# EAGLE design motors (EAGLE 9.3.0)
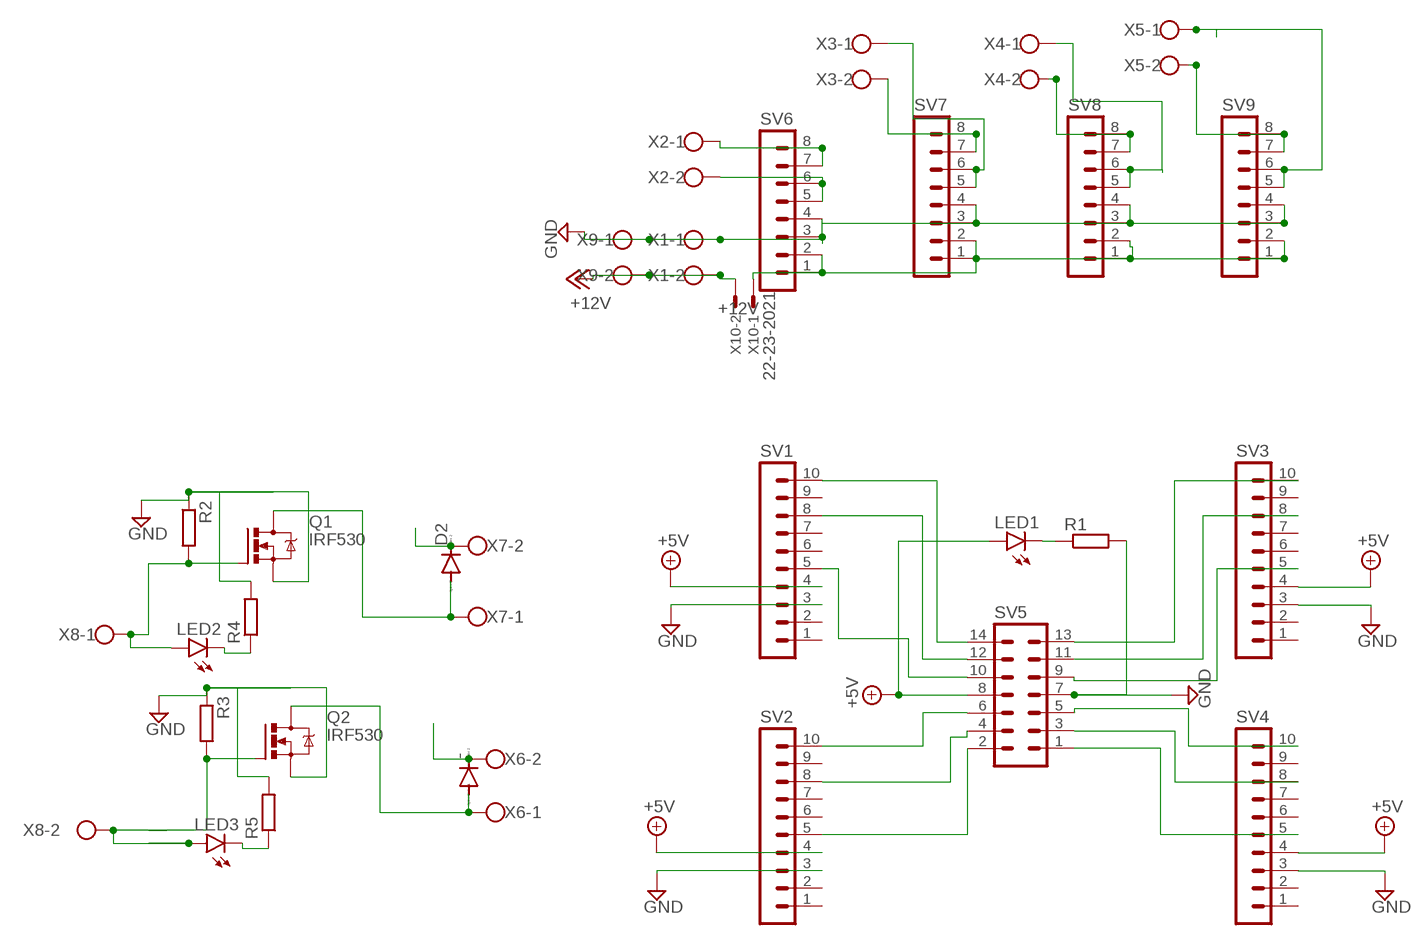
[diagram p0: schematic, sheet 1]

## Parts
-  DIODE-DO41-7.6  [DO41-7.6]
D2  DIODE-DO41-7.6  [DO41-7.6]
LED1  LED5MM  [LED5MM]
LED2  LED5MM  [LED5MM]
LED3  LED5MM  [LED5MM]
Q1  IRF530  [TO220BV]
Q2  IRF530  [TO220BV]
R1  R-EU_0207/7  [0207/7]
R2  R-EU_0207/7  [0207/7]
R3  R-EU_0207/7  [0207/7]
R4  R-EU_0207/7  [0207/7]
R5  R-EU_0207/7  [0207/7]
SV1  MA10-1  [MA10-1]
SV2  MA10-1  [MA10-1]
SV3  MA10-1  [MA10-1]
SV4  MA10-1  [MA10-1]
SV5  MA07-2  [MA07-2]
SV6  MA08-1  [MA08-1]
SV7  MA08-1  [MA08-1]
SV8  MA08-1  [MA08-1]
SV9  MA08-1  [MA08-1]
X1  W237-102  [W237-102]
X2  W237-102  [W237-102]
X3  W237-102  [W237-102]
X4  W237-102  [W237-102]
X5  W237-102  [W237-102]
X6  W237-102  [W237-102]
X7  W237-102  [W237-102]
X8  W237-102  [W237-102]
X9  W237-102  [W237-102]
X10  22-23-2021  [22-23-2021]

## Nets
+5V: LED1.A SV1.4 SV2.4 SV3.4 SV4.4 SV5.8
+12V: X1.2 X9.2 X10.2
GND: Q1.S Q2.S R1.2 R2.1 R3.1 R4.2 R5.2 SV1.3 SV2.3 SV3.3 SV4.3 SV5.7 SV6.3 SV6.4 SV7.3 SV7.4 SV8.3 SV8.4 SV9.3 SV9.4 X1.1 X9.1
N$1: SV3.10 SV5.13
N$2: SV3.8 SV5.11
N$3: SV3.5 SV5.9
N$4: SV4.10 SV5.5
N$5: SV4.8 SV5.3
N$6: SV4.5 SV5.1
N$7: SV2.5 SV5.2
N$8: SV2.8 SV5.4
N$9: SV2.10 SV5.6
N$10: SV1.5 SV5.10
N$11: SV1.8 SV5.12
N$12: SV1.10 SV5.14
N$13: LED1.K(C) R1.1
N$14: LED2.K(C) R4.1
N$15: LED3.A Q2.G R3.2 X8.2
N$16: D2.A Q1.D X7.1
N$18: LED3.K(C) R5.1
N$19: -.A Q2.D X6.1
N$20: SV9.7 SV9.8 X5.2
N$22: -.C D2.C SV6.1 SV6.2 SV7.1 SV7.2 SV8.1 SV8.2 SV9.1 SV9.2 X6.2 X7.2 X10.1
N$23: SV6.7 SV6.8 X2.1
N$24: SV6.5 SV6.6 X2.2
N$25: SV7.5 SV7.6 X3.1
N$26: SV7.7 SV7.8 X3.2
N$27: SV8.5 SV8.6 X4.1
N$29: LED2.A Q1.G R2.2 X8.1
N$30: SV8.7 SV8.8 X4.2
N$34: SV9.5 SV9.6 X5.1
Unconnected: SV1.1 SV1.2 SV1.6 SV1.7 SV1.9 SV2.1 SV2.2 SV2.6 SV2.7 SV2.9 SV3.1 SV3.2 SV3.6 SV3.7 SV3.9 SV4.1 SV4.2 SV4.6 SV4.7 SV4.9

## Library data of the parts
- D2 = diode:DIODE-: DIODE
LED1-LED3 = led:LED: LED OSRAM: - CHIPLED LG R971, LG N971, LY N971, LG Q971, LY Q971, LO R971, LY R971 LH N974, LH R974 LS Q976, LO Q976, LY Q976 LO Q996 - Hyper CHIPLED LW Q18S LB Q993, LB Q99A, LB R99A - SideLED LS A670, LO A670, LY A670, LG A670, LP A670 LB A673, LV A673, LT A673, LW A673 LH A674 LY A675 LS A676, LA A676, LO A676, LY A676, LW A676 LS A679, LY A679, LG A679 - Hyper Micro SIDELED® LS Y876, LA Y876, LO Y876, LY Y876 LT Y87S - SmartLED LW L88C, LW L88S LB L89C, LB L89S, LG L890 LS L89K, LO L89K, LY L89K LS L896, LA L896, LO L896, LY L896 - TOPLED LS T670, LO T670, LY T670, LG T670, LP T670 LSG T670, LSP T670, LSY T670, LOP T670, LYG T670 LG T671, LOG T671, LSG T671 LB T673, LV T673, LT T673, LW T673 LH T674 LS T676, LA T676, LO T676, LY T676, LB T676, LH T676, LSB T676, LW T676 LB T67C, LV T67C, LT T67C, LS T67K, LO T67K, LY T67K, LW E67C LS E67B, LA E67B, LO E67B, LY E67B, LB E67C, LV E67C, LT E67C LW T67C LS T679, LY T679, LG T679 LS T770, LO T770, LY T770, LG T770, LP T770 LB T773, LV T773, LT T773, LW T773 LH T774 LS E675, LA E675, LY E675, LS T675 LS T776, LA T776, LO T776, LY T776, LB T776 LHGB T686 LT T68C, LB T68C - Hyper Mini TOPLED® LB M676 - Mini TOPLED Santana® LG M470 LS M47K, LO M47K, LY M47K Source: http://www.osram.convergy.de LUXEON: - LUMILED® LXK2-PW12-R00, LXK2-PW12-S00, LXK2-PW14-U00, LXK2-PW14-V00 LXK2-PM12-R00, LXK2-PM12-S00, LXK2-PM14-U00 LXK2-PE12-Q00, LXK2-PE12-R00, LXK2-PE12-S00, LXK2-PE14-T00, LXK2-PE14-U00 LXK2-PB12-K00, LXK2-PB12-L00, LXK2-PB12-M00, LXK2-PB14-N00, LXK2-PB14-P00, LXK2-PB14-Q00 LXK2-PR12-L00, LXK2-PR12-M00, LXK2-PR14-Q00, LXK2-PR14-R00 LXK2-PD12-Q00, LXK2-PD12-R00, LXK2-PD12-S00 LXK2-PH12-R00, LXK2-PH12-S00 LXK2-PL12-P00, LXK2-PL12-Q00, LXK2-PL12-R00 Source: www.luxeon.com KINGBRIGHT: KA-3528ASYC Source: www.kingbright.com
Q1 Q2 = transistor-power:IRF530: HEXFET Power MOSFET
R1-R5 = rcl:R-EU_: RESISTOR, European symbol; SPICEPREFIX: R
SV1-SV4 = con-lstb:MA10-1: PIN HEADER; OC_FARNELL: unknown; OC_NEWARK: unknown
SV5 = con-lstb:MA07-2: PIN HEADER; OC_FARNELL: unknown; OC_NEWARK: unknown
SV6-SV9 = con-lstb:MA08-1: PIN HEADER; OC_FARNELL: unknown; OC_NEWARK: unknown
X1-X9 = con-wago-500:W237-102: WAGO SCREW CLAMP; MPN: 237-102; OC_FARNELL: unknown; OC_NEWARK: 70K9898
X10 = con-molex:22-23-2021: .100" (2.54mm) Center Header - 2 Pin; MF: MOLEX; MPN: 22-23-2021; OC_FARNELL: 1462926; OC_NEWARK: 25C3832

## Board
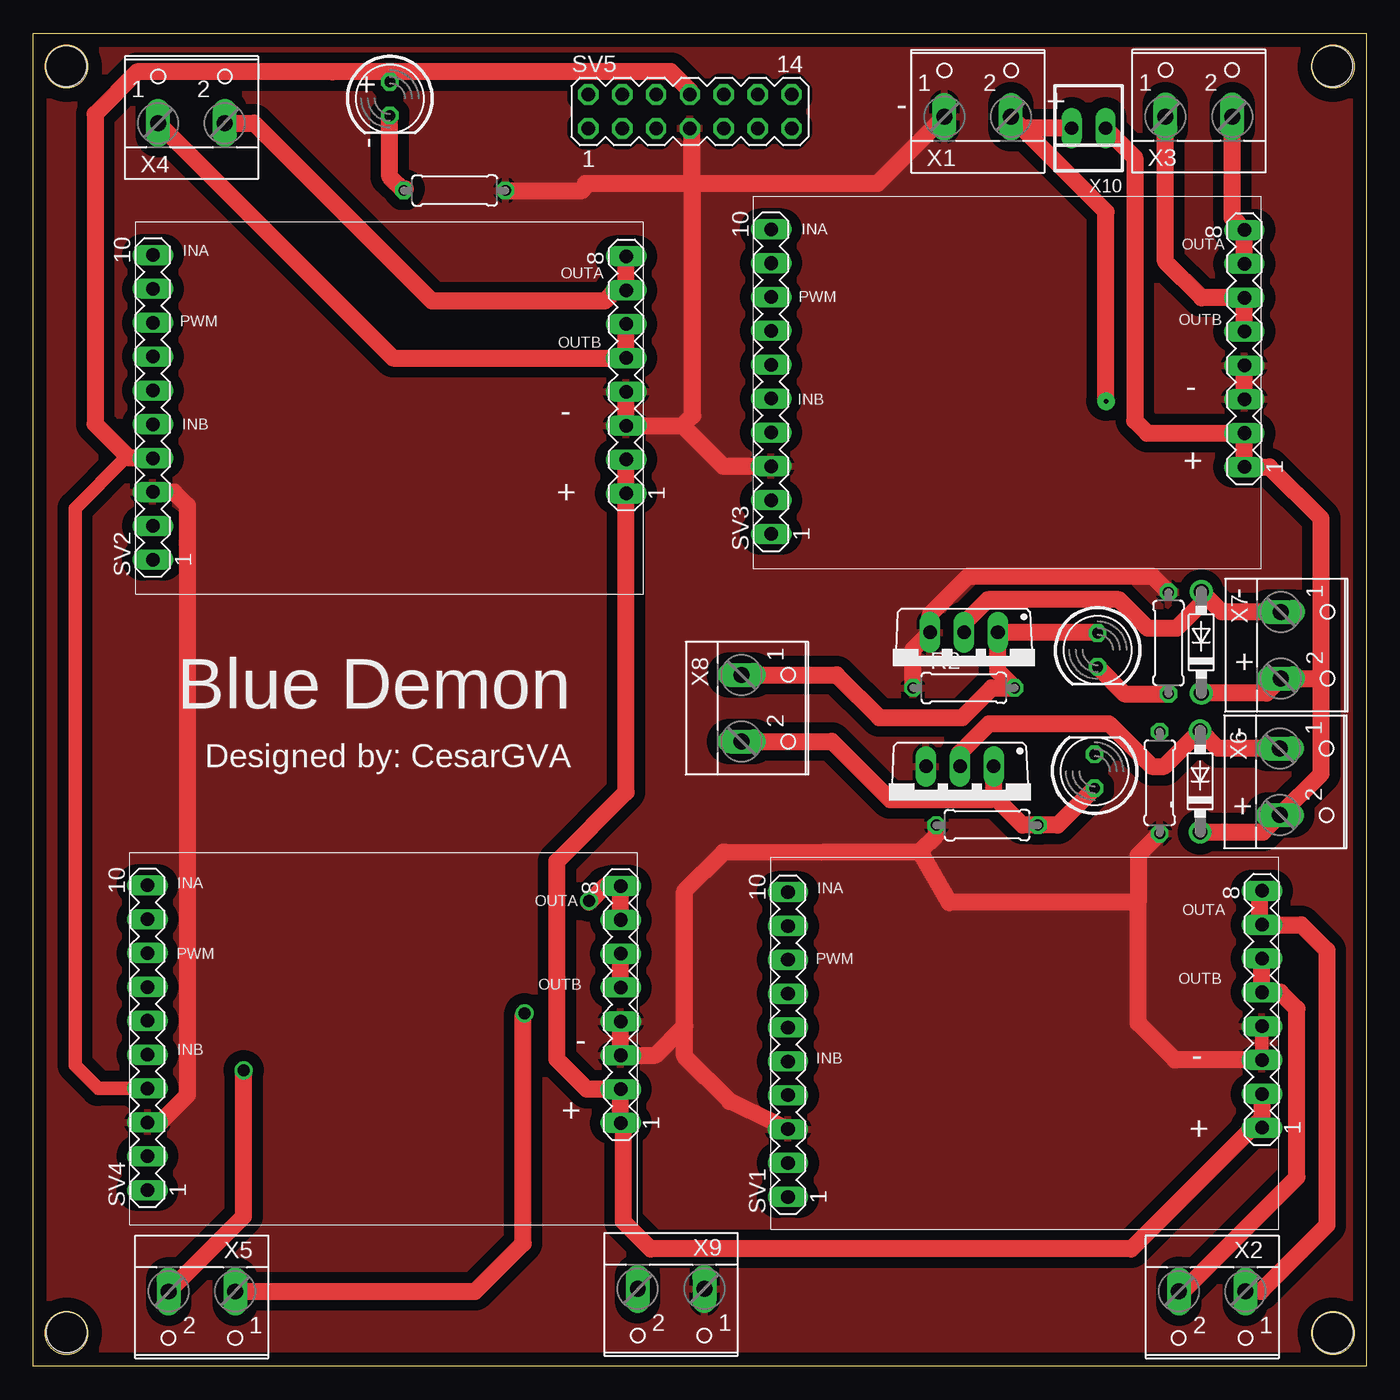
[diagram p1: board, top side]
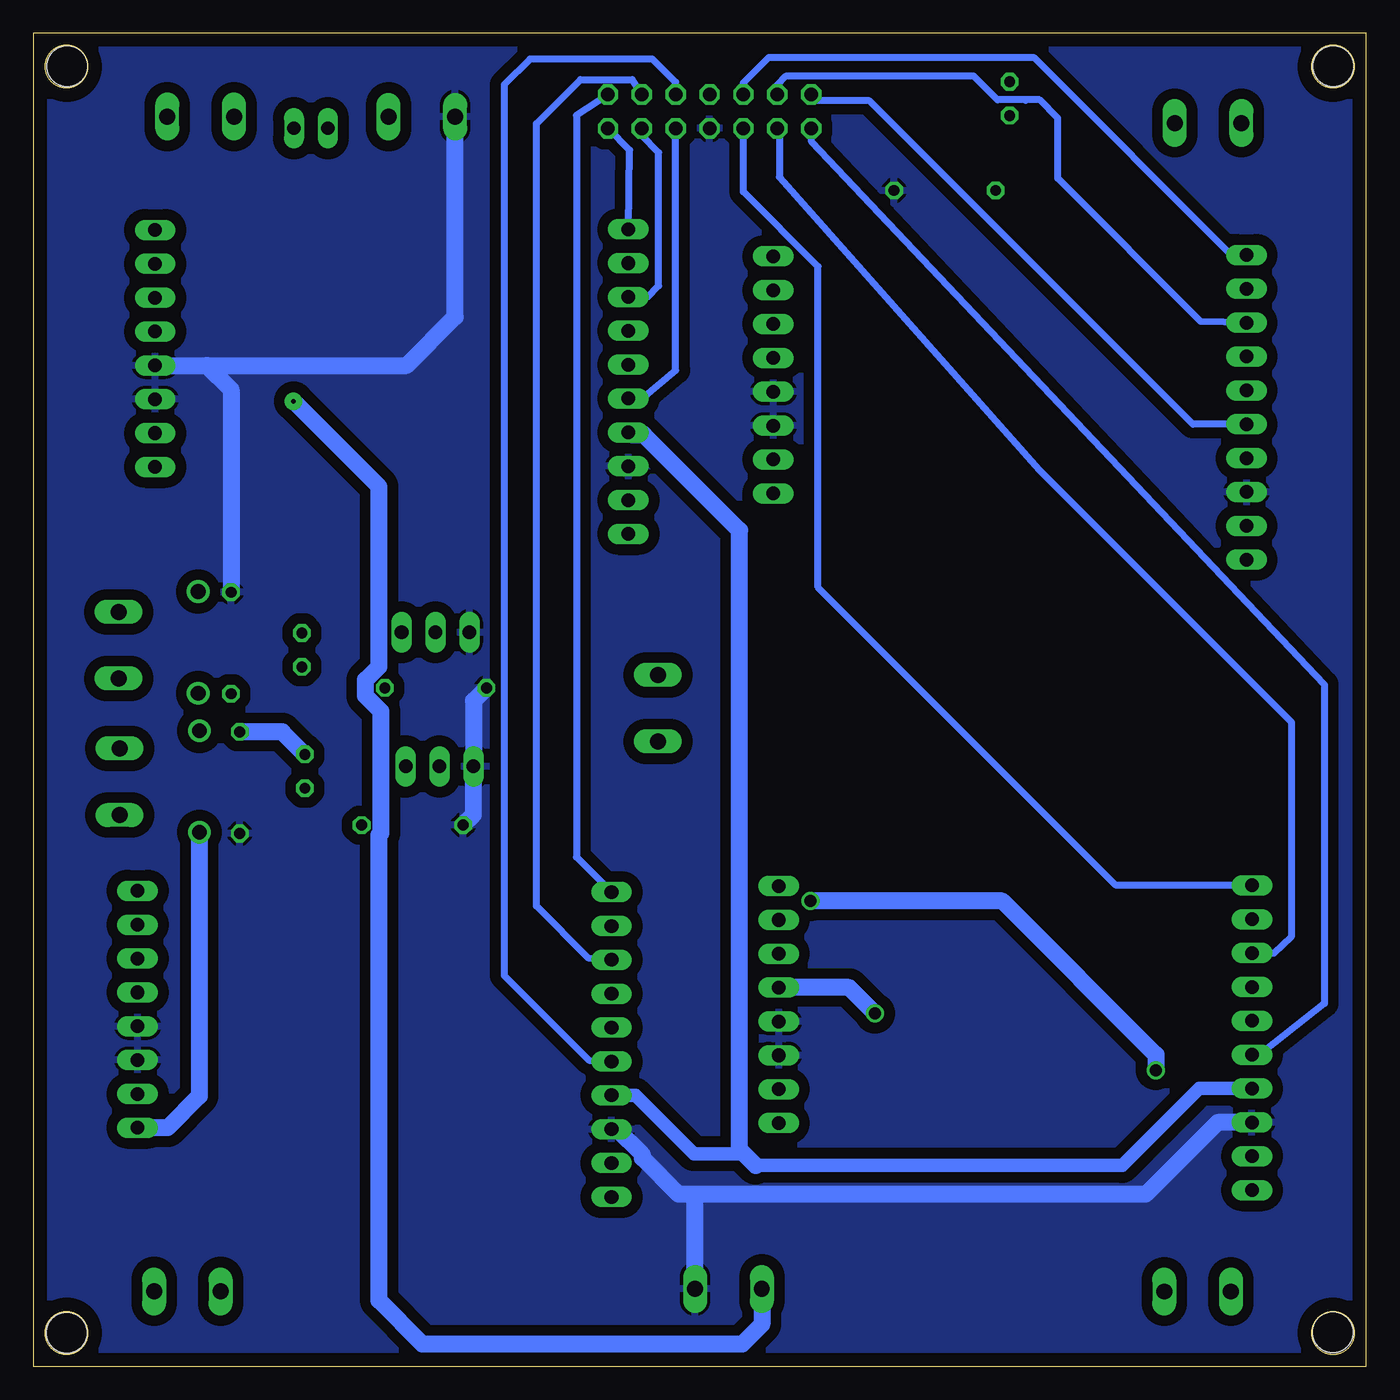
[diagram p2: board, bottom side, seen from below]

Size 100 x 100 mm. Coordinates in mm from the lower left corner, seen from the top.
Outline: 0,100 100,100 100,0 0,0 0,100
Outline: circle at 2.5,97.5 radius 1.6
Outline: circle at 97.5,97.5 radius 1.6
Outline: circle at 97.5,2.5 radius 1.6
Outline: circle at 2.5,2.5 radius 1.6
Copper layers (1*16): Top 0.035mm / dielectric 1.5mm / Bottom 0.035mm
Design rules "default": minimum track width 6mil, minimum drill 0.35mm, track to track 6mil, track to pad 6mil, pad to pad 6mil, via to via 6mil, smd to smd 6mil, copper to edge 40mil, drill to drill 6mil, minimum pad ring 10mil, minimum via ring 8mil, stop-mask expansion 4mil, vias tented up to drill 0mil, thermal gap 10mil
Holes 3.05 mm at 2.48,97.53 97.47,97.55 97.51,2.52 2.49,2.55

### Footprints (pad centres in the part's own frame; a part is rotated, then mirrored left to right if it is on the bottom)
DO41-7.6 = drill 1.1 pad 1.7: A 3.81,0; C -3.81,0
LED5MM = drill 0.813 octagon: A -1.27,0; K 1.27,0
TO220BV = drill 1.016 long: D 0,-2.54; G -2.54,-2.54; S 2.54,-2.54
0207/7 = drill 0.813 octagon: 1 -3.81,0; 2 3.81,0
MA10-1 = drill 1.016 long: 1 -11.43,0; 2 -8.89,0; 3 -6.35,0; 4 -3.81,0; 5 -1.27,0; 6 1.27,0; 7 3.81,0; 8 6.35,0; 9 8.89,0; 10 11.43,0
MA07-2 = drill 1.016 octagon: 1 -7.62,-1.27; 2 -7.62,1.27; 3 -5.08,-1.27; 4 -5.08,1.27; 5 -2.54,-1.27; 6 -2.54,1.27; 7 0,-1.27; 8 0,1.27; 9 2.54,-1.27; 10 2.54,1.27; 11 5.08,-1.27; 12 5.08,1.27; 13 7.62,-1.27; 14 7.62,1.27
MA08-1 = drill 1.016 long: 1 -8.89,0; 2 -6.35,0; 3 -3.81,0; 4 -1.27,0; 5 1.27,0; 6 3.81,0; 7 6.35,0; 8 8.89,0
W237-102 = drill 1.194 long: 1 -2.5,-1.27; 2 2.5,-1.27
22-23-2021 = drill 1 long: 1 -1.27,0; 2 1.27,0

### Placement (x,y rotation side)
-  87.54,43.87 90 top
D2  87.63,54.31 90 top
LED1  26.75,95.1 270 top
LED2  79.85,53.74 270 top
LED3  79.63,44.64 90 top
Q1  69.83,52.52 180 top
Q2  69.53,42.46 180 top
R1  31.61,88.21 0 top
R2  69.82,50.89 0 top
R3  71.56,40.6 0 top
R4  85.17,54.26 90 top
R5  84.51,43.78 270 top
SV1  56.62,24.13 90 top
SV2  8.97,71.94 90 top
SV3  55.35,73.87 90 top
SV4  8.56,24.64 90 top
SV5  49.27,94.13 0 top
SV6  92.18,26.77 90 top
SV7  90.86,76.36 90 top
SV8  44.48,74.37 90 top
SV9  44.07,27.13 90 top
X1  70.86,95.01 0 top
X2  88.44,4.34 180 top
X3  87.44,95.03 0 top
X4  11.87,94.54 0 top
X5  12.64,4.33 180 top
X6  94.8,43.84 270 top
X7  94.88,54.09 270 top
X8  54.41,49.37 270 top
X9  47.85,4.52 180 top
X10  79.17,92.88 180 top

### Tracks (layer width: path | path; a pad name or v marks a point on that pad's centre or on a via)
+5V
  Top 1.016: SV4.4 4.87,20.83 3.13,22.57 3.13,64.35 6.86,68.08 8.93,68.08 SV2.4
  Top 1.27: SV2.4 8.94,68.15 7.16,68.15 4.63,70.68 4.63,93.94 7.79,97.11 22.44,97.11 22.43,97.12 26.91,97.12 | SV5.8 49.27,95.7 47.84,97.12 26.91,97.12 | LED1.A 26.91,97.12
  Bottom 1.016: SV1.4 54.82,20.32 50.44,15.94 46.69,15.94 | 45.81,15.06 18.3,15.06 12.53,20.83 SV4.4 8.66,20.73
  Bottom 1.27: 45.81,15.06 46.69,15.94 47.02,16.27 47.02,62.71 54.22,69.9 55.2,69.9 SV3.4
+12V  (via drill 0.35 pad 1.3)
  Top 1.27: v80.49,72.4 80.49,86.61 X1.2 74.21,92.88 X10.2
  Bottom 1.27: X9.2 45.35,3.13 46.83,1.65 70.8,1.65 74.07,4.93 74.07,39.84 73.92,40 73.92,49.13 75.07,50.29 75.07,51.49 74.07,52.49 74.07,65.99 v80.49,72.4
GND
  Top 1.016: SV6.3 SV6.4
  Top 1.27: SV4.3 9.53,18.29 11.56,20.32 11.56,64.57 10.55,65.59 SV2.3 | R1.2 41.21,88.21 41.43,88.75 49.4,88.75 | SV1.3 52.25,19.87 48.86,23.25 48.86,25.52 | SV9.4 SV9.3 46.66,23.32 48.86,25.52 | SV7.3 SV7.4 | 66.52,38.61 51.9,38.56 51.77,38.56 48.86,35.66 48.86,25.52 | 66.52,38.61 68.73,34.79 82.89,34.79 | R2.1 66.01,53.78 Q1.S 67.29,56.36 67.34,56.41 67.34,56.46 70.14,59.26 83.97,59.26 R4.2 | R5.2 82.89,38.35 82.89,34.79 | SV6.3 85.67,22.96 82.89,25.74 82.89,34.79 | SV8.4 SV8.3 48.71,70.56 | 66.52,38.61 67.75,39.83 R3.1 | 49.4,88.75 49.4,92.73 SV5.7 | 49.4,88.75 63.36,88.75 X1.1 | 48.71,70.56 51.76,67.52 SV3.3 | 48.71,70.56 49.46,71.31 49.46,88.69 49.4,88.75
  Bottom 1.27: 50.1,12.9 16.53,12.9 11.15,18.29 SV4.3 | 50.1,12.9 51.59,12.9 54.31,15.62 54.31,15.88 56.21,17.78 SV1.3 | SV8.3 44.53,70.61 | R2.1 66.99,49.91 Q2.S 66.99,41.36 R3.1 | SV7.4 86.98,75.09 | 86.98,75.09 72.01,75.09 68.36,78.74 X1.1 | 86.98,75.09 85.17,73.28 R4.2 | X9.1 50.35,12.66 50.1,12.9
  pour Top (isolate 0.813): 1.21,99.54 98.4,99.54 99.33,98.61 99.33,0.34 98.4,-0.59 1.59,-0.59 -0.64,1.64 -0.64,97.7 1.21,99.55
  pour Bottom (isolate 0.813): 0.07,101.44 100.84,101.44 101.26,101.02 101.26,-1.15 101.24,-1.17 -1.46,-1.17 -1.46,99.91
N$1
  Bottom 0.508: SV3.10 55.26,91.24 SV5.13
N$2
  Bottom 0.508: SV3.8 53.93,80.22 53.08,81.06 53.08,91.06 54.35,92.32 SV5.11
N$3
  Bottom 0.508: SV3.5 54.35,72.6 51.8,74.71 51.81,74.71 SV5.9
N$4
  Bottom 0.508: SV4.10 18.77,36.07 41.13,58.42 41.13,82.5 46.73,88.1 SV5.5
N$5
  Bottom 0.508: SV4.8 6.9,30.99 5.59,32.25 5.59,48.3 24.51,67.22 44.02,89.21 44.02,92.7 SV5.3
N$6
  Bottom 0.508: SV5.1 41.65,91.91 3.13,51.13 3.13,27.2 8.31,23.12 SV4.5
N$7
  Bottom 0.508: SV5.2 41.22,94.98 37.31,94.98 13,70.67 SV2.5
N$8
  Bottom 0.508: 25.55,94.96 25.56,95 | 25.56,95 27.65,95 29.45,96.8 43.52,96.8 44.19,96.13 SV5.4 | 8.97,78.35 SV2.8 12.41,78.38 23.15,89.12 23.15,93.65 24.5,95 25.56,95
N$9
  Bottom 0.508: SV5.6 46.73,96.28 44.82,98.19 24.94,98.19 10.12,83.37 SV2.10
N$10
  Bottom 0.508: SV5.10 51.81,96.33 53.55,98.07 62.74,98.07 64.66,96.15 64.66,29.3 58.31,22.95 SV1.5
N$11
  Bottom 0.508: SV1.8 58.34,30.59 62.26,34.52 62.26,93.22 58.96,96.52 55.08,96.52 SV5.12
N$12
  Bottom 0.508: SV5.14 59.26,93.85 59.26,38.2 SV1.10
N$13
  Top 1.27: 27.92,88.33 R1.1 26.75,89.26 LED1.K
N$14
  Top 1.27: LED2.K 81.87,50.45 R4.1
N$15
  Top 1.27: X8.2 59.91,46.87 64.27,42.51 71.83,42.51 72.07,42.74 | 72.07,42.74 Q2.G | 72.07,42.74 74.21,40.6 R3.2 76.86,40.6 LED3.A
N$16
  Top 1.27: X7.1 89.15,56.59 D2.A 87.63,57.21 85.77,55.35 83.62,55.35 81.46,57.5 71.6,57.5 69.83,55.73 Q1.D
N$18
  Bottom 1.27: LED3.K 81.31,47.59 R5.1
N$19
  Top 1.27: Q2.D 69.52,46.01 71.72,48.21 80.69,48.21 83.91,45 84.85,45 -.A 88.88,46.34 X6.1
N$20  (via drill 0.9 pad 1.3)
  Top 1.27: SV9.7 SV9.8 42.9,36.02 41.68,34.8 v41.68,34.9 | X5.2 15.78,11.23 v15.78,22.2
  Bottom 1.27: v41.68,34.9 27.31,34.9 15.78,23.37 v15.78,22.2
N$22
  Top 1.27: SV8.2 SV8.1 44.48,43.08 39.28,37.88 39.28,23.03 41.53,20.78 SV9.2 SV9.1 44.26,18.05 44.26,10.84 46.31,8.79 82.38,8.79 91.82,18.24 | 91.82,18.24 SV6.1 | SV6.2 92.18,18.6 91.82,18.24 | X10.1 82.64,90.68 82.64,70.93 83.57,70.01 SV7.2 SV7.1 92.74,67.47 96.63,63.58 96.63,51.71 | 96.63,51.71 96.63,44.44 X6.2 92.25,40.06 -.C | D2.C 92.51,50.5 X7.2 96.51,51.59 96.63,51.71
  Bottom 1.27: -.C 87.54,20.28 89.93,17.88 SV6.1
N$23
  Top 1.27: SV6.8 91.98,35.46 91.98,33.33 SV6.7 95.13,33.12 97.06,31.19 97.06,10.57 92.09,5.61 X2.1
N$24
  Top 1.27: X2.2 86.24,5.9 86.51,5.9 94.79,14.18 94.79,26.81 93.56,28.04 SV6.5 SV6.6
N$25
  Top 1.27: SV7.5 SV7.6 87.66,80.17 84.94,82.88 X3.1
N$26
  Top 1.27: SV7.7 SV7.8 89.94,86.16 X3.2
N$27
  Top 1.27: SV8.6 SV8.5 26.99,75.64 X4.1
N$29
  Top 1.27: LED2.A 79.8,55.06 Q1.G 72.37,52.14 R2.2 71.91,50.89 69.69,48.66 63.47,48.66 60.26,51.87 X8.1
N$30
  Top 1.27: SV8.8 SV8.7 43.69,80.72 42.88,79.92 29.92,79.92 16.56,93.27 X4.2
N$34  (via drill 0.9 pad 1.3)
  Top 1.27: SV9.5 SV9.6 | X5.1 33.14,5.6 36.76,9.22 36.76,26.37 v36.86,26.47
  Bottom 1.27: v36.86,26.47 38.79,28.4 SV9.5

### Text on the board
tNames: + | - | + | - | INA | INA | OUTA | OUTA | PWM | PWM | OUTB | OUTB | INB | - | INB | - | + | + | - | + | Blue Demon | - | Designed by: CesarGVA | + | INA | INA | OUTA | OUTA | PWM | PWM | OUTB | OUTB | INB | - | INB | - | + | +